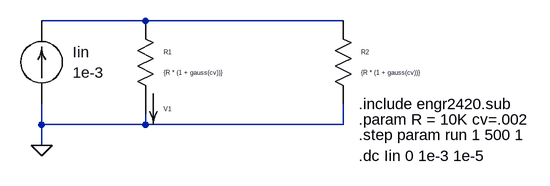
[diagram p0: schematic Experiment 2.asc]
Experiment 2.asc, the LTspice schematic file:
Version 4
SHEET 1 880 680
WIRE 208 32 48 32
WIRE 512 32 208 32
WIRE 48 192 48 160
WIRE 208 192 208 176
WIRE 208 192 48 192
WIRE 512 192 512 160
WIRE 512 192 208 192
WIRE 48 224 48 192
FLAG 48 224 0
SYMBOL cktsym\\isource 48 96 M180
WINDOW 3 48 -16 Left 2
WINDOW 0 48 16 Left 2
SYMATTR Value 1e-3
SYMATTR InstName Iin
SYMBOL cktsym\\resistor 512 96 R0
SYMATTR Value {R * (1 + gauss(cv))}
SYMATTR InstName R2
SYMBOL cktsym\\resistor 208 96 R0
SYMATTR Value {R * (1 + gauss(cv))}
SYMATTR InstName R1
SYMBOL cktsym\\ammeter1 208 160 R0
SYMATTR InstName V1
TEXT 536 160 Left 2 !.include engr2420.sub
TEXT 536 184 Left 2 !.param R = 10K cv=.002
TEXT 536 208 Left 2 !.step param run 1 500 1
TEXT 536 240 Left 2 !.dc Iin 0 1e-3 1e-5

The netlist it stands for:
* Experiment 2.asc
Iin 0 N001 1e-3
R2 N001 0 {R * (1 + gauss(cv))}
R1 N001 P001 {R * (1 + gauss(cv))}
V1 P001 0 0
.include engr2420.sub
.param R = 10K cv=.002
.step param run 1 500 1
.dc Iin 0 1e-3 1e-5
.backanno
.end